# Altium schematic sheet Inverter_Power_Stage.SchDoc
size A4; SheetNumber: 4; SheetTotal: 5
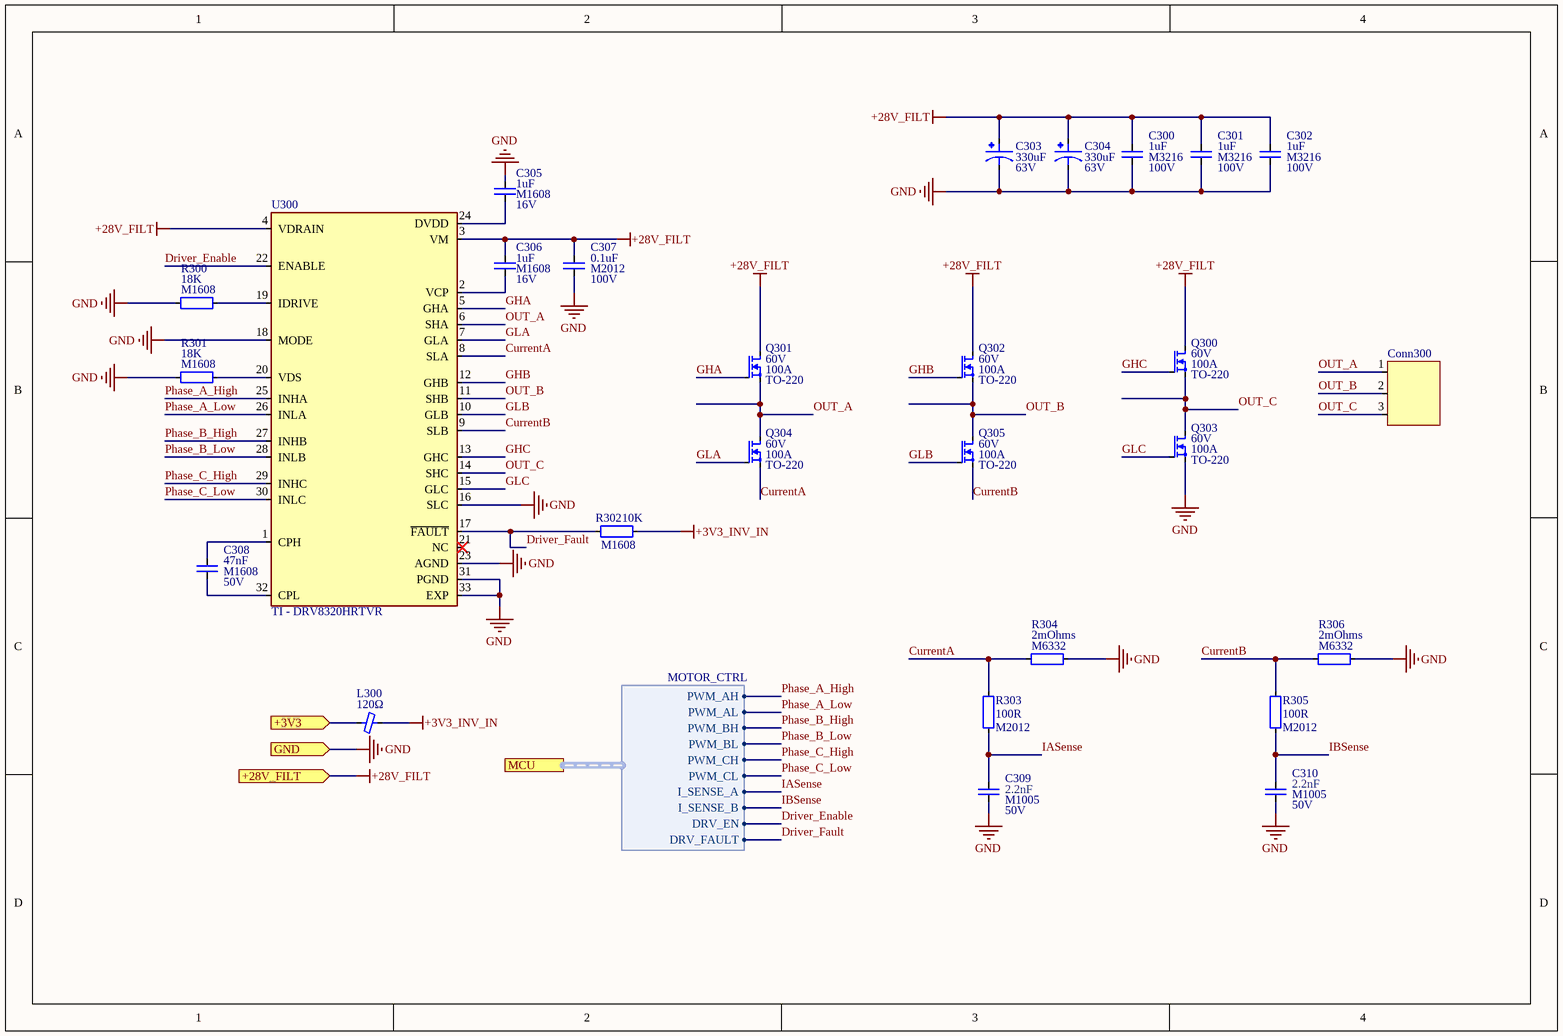
[diagram p0: Inverter_Power_Stage.SchDoc]

## Parts
C300  value 1uF  Package: M3216  Rated Voltage: 100V  [Capacitor_Seramic_M3216_I1206]  (hidden comment: Capacitor_Seramic)
C301  value 1uF  Package: M3216  Rated Voltage: 100V  [Capacitor_Seramic_M3216_I1206]  (hidden comment: Capacitor_Seramic)
C302  value 1uF  Package: M3216  Rated Voltage: 100V  [Capacitor_Seramic_M3216_I1206]  (hidden comment: Capacitor_Seramic)
C303  value 330uF  Rated Voltage: 63V  [Capacitor_Aluminum_TH]  (hidden comment: Capacitor_Aluminum_TH)
C304  value 330uF  Rated Voltage: 63V  [Capacitor_Aluminum_TH]  (hidden comment: Capacitor_Aluminum_TH)
C305  value 1uF  Package: M1608  Rated Voltage: 16V  [Capacitor_Seramic_M1608_I0603]  (hidden comment: Capacitor_Seramic)
C306  value 1uF  Package: M1608  Rated Voltage: 16V  [Capacitor_Seramic_M1608_I0603]  (hidden comment: Capacitor_Seramic)
C307  value 0.1uF  Package: M2012  Rated Voltage: 100V  [Capacitor_Seramic_M2012_I0805]  (hidden comment: Capacitor_Seramic)
C308  value 47nF  Package: M1608  Rated Voltage: 50V  [Capacitor_Seramic_M1608_I0603]  (hidden comment: Capacitor_Seramic)
C309  value 2.2nF  Package: M1005  Rated Voltage: 50V  [Capacitor_Seramic_M1005_I0402]  (hidden comment: Capacitor_Seramic)
C310  value 2.2nF  Package: M1005  Rated Voltage: 50V  [Capacitor_Seramic_M1005_I0402]  (hidden comment: Capacitor_Seramic)
Conn300  Connector - 3P  [Phoenix- 3Pin, 1714968]  (value not drawn)
L300  value 120Ω  [Ferrite_Bead_Smd_M1608_I0603]  (hidden comment: Ferrite Bead)
Q300  Current: 100A  Voltage: 60V  Package: TO-220  [TO-220-3, Mosfet, N-Channel]  (hidden comment: Mosfet, N-Channel - TI - CSD18532KCS)
Q301  Current: 100A  Voltage: 60V  Package: TO-220  [TO-220-3, Mosfet, N-Channel]  (hidden comment: Mosfet, N-Channel - TI - CSD18532KCS)
Q302  Current: 100A  Voltage: 60V  Package: TO-220  [TO-220-3, Mosfet, N-Channel]  (hidden comment: Mosfet, N-Channel - TI - CSD18532KCS)
Q303  Current: 100A  Voltage: 60V  Package: TO-220  [TO-220-3, Mosfet, N-Channel]  (hidden comment: Mosfet, N-Channel - TI - CSD18532KCS)
Q304  Current: 100A  Voltage: 60V  Package: TO-220  [TO-220-3, Mosfet, N-Channel]  (hidden comment: Mosfet, N-Channel - TI - CSD18532KCS)
Q305  Current: 100A  Voltage: 60V  Package: TO-220  [TO-220-3, Mosfet, N-Channel]  (hidden comment: Mosfet, N-Channel - TI - CSD18532KCS)
R300  value 18K  Package: M1608  [Resistor_SMD_M1608_I0603]  (hidden comment: Resistor)
R301  value 18K  Package: M1608  [Resistor_SMD_M1608_I0603]  (hidden comment: Resistor)
R302  value 10K  Package: M1608  [Resistor_SMD_M1608_I0603]  (hidden comment: Resistor)
R303  value 100R  Package: M2012  [Resistor_SMD_M2012_I0805]  (hidden comment: Resistor)
R304  value 2mOhms  Package: M6332  [Resistor_SMD_M6332_I2512]  (hidden comment: Resistor)
R305  value 100R  Package: M2012  [Resistor_SMD_M2012_I0805]  (hidden comment: Resistor)
R306  value 2mOhms  Package: M6332  [Resistor_SMD_M6332_I2512]  (hidden comment: Resistor)
U300  TI - DRV8320HRTVR  [QFN-48 5mm x 5mm]

## Ports
+3V3 (in), +28V_FILT (in), GND (in), MCU (harness MOTOR_CTRL)

## Harnesses
MOTOR_CTRL: PWM_AH, PWM_AL, PWM_BH, PWM_BL, PWM_CH, PWM_CL, I_SENSE_A, I_SENSE_B, DRV_EN, DRV_FAULT

## Nets
+3V3_INV_IN: L300.2 R302.2
+28V_FILT: C300.1 C301.1 C302.1 C303.P C304.P C306.1 C307.1 Q300.D Q301.D Q302.D U300.3(VM) U300.4(VDRAIN) ; port +28V_FILT
GND: C300.2 C301.2 C302.2 C303.N C304.N C305.1 C307.2 C309.1 C310.2 Q303.S R300.1 R301.1 R304.2 R306.2 U300.16(SLC) U300.18(MODE) U300.23(AGND) U300.31(PGND) U300.33(EXP) ; port GND
+3V3: L300.1 ; port +3V3
CurrentA: Q304.S R303.2 R304.1 U300.8(SLA)
CurrentB: Q305.S R305.2 R306.1 U300.9(SLB)
Driver_Enable: U300.22(ENABLE) ; port MCU.DRV_EN
Driver_Fault: R302.1 U300.17(~{FAULT}) ; port MCU.DRV_FAULT
GHA: Q301.G U300.5(GHA)
GHB: Q302.G U300.12(GHB)
GHC: Q300.G U300.13(GHC)
GLA: Q304.G U300.7(GLA)
GLB: Q305.G U300.10(GLB)
GLC: Q303.G U300.15(GLC)
IASense: C309.2 R303.1 ; port MCU.I_SENSE_A
IBSense: C310.1 R305.1 ; port MCU.I_SENSE_B
OUT_A: Conn300.1 Q301.S Q304.D U300.6(SHA)
OUT_B: Conn300.2 Q302.S Q305.D U300.11(SHB)
OUT_C: Conn300.3 Q300.S Q303.D U300.14(SHC)
Phase_A_High: U300.25(INHA) ; port MCU.PWM_AH
Phase_A_Low: U300.26(INLA) ; port MCU.PWM_AL
Phase_B_High: U300.27(INHB) ; port MCU.PWM_BH
Phase_B_Low: U300.28(INLB) ; port MCU.PWM_BL
Phase_C_High: U300.29(INHC) ; port MCU.PWM_CH
Phase_C_Low: U300.30(INLC) ; port MCU.PWM_CL
NetC305_2: C305.2 U300.24(DVDD)
NetC306_2: C306.2 U300.2(VCP)
NetC308_1: C308.1 U300.1(CPH)
NetC308_2: C308.2 U300.32(CPL)
NetR300_2: R300.2 U300.19(IDRIVE)
NetR301_2: R301.2 U300.20(VDS)

Not connected (* = marked no-connect by the designer): U300 21(NC)*

## Library data of the parts
C300-C302 = Capacitor_Seramic: Cap, Cer, 1uF, 100V, M3216; Manufacturer Part Number: C3216X7R2A105K160AA; Manufacturer: TDK Corporation; Tolerance: ±10%; Temperature Coefficient: X7R; ComponentLink1Description: Datasheet; ComponentLink1URL: *; ComponentLink2Description: Supplier Link; ComponentLink2URL: https://www.digikey.com/en/products/detail/tdk-corporation/C3216X7R2A105K160AA/2042138; Supplier Part Number: 445-4467-1-ND; Supplier Link: https://www.digikey.com/en/products/detail/tdk-corporation/C3216X7R2A105K160AA/2042138; Supplier Currency: $; Supplier: Digikey; Quantity, Min: 1; Quantity, Max: 1,000; Price, Min: $0.41000; Price, Max: $0.12024; Operating Temperature, Min: -55℃; Operating Temperature, Max: +125℃; Component Type: Ceramic; Component Category: Capacitor
C303 C304 = Capacitor_Aluminum_TH: 220F 63V Aluminum Electrolytic Capacitors Radial, Can 10000 Hrs @ 105C; Manufacturer: Panasonic Electronic Components; Manufacturer Part Number: EEU-FR1J331; Tolerance: ±20%; Temperature Coefficient: *; Component Category: Capacitor; Component Type: Aluminum; Operating Temperature, Max: +105°C; Operating Temperature, Min: -40°C; ComponentLink1Description: Supplier Link; ComponentLink1URL: https://www.digikey.com/en/products/detail/panasonic-electronic-components/EEU-FR1J331/P15413-ND/3072293; Supplier Part Number: P15413-ND; Supplier Link: https://www.digikey.com/en/products/detail/panasonic-electronic-components/EEU-FR1J331/P15413-ND/3072293; Supplier Currency: $; Supplier: Digikey; Quantity, Min: 1; Quantity, Max: 5,000; Price, Min: $1.73000; Price, Max: $0.51428
C305 C306 = Capacitor_Seramic: Cap, Cer, 1uF, 16V, M1608; Manufacturer Part Number: CL10B105KO8NNNC; Manufacturer: Samsung Electro-Mechanics; Tolerance: ±10%; Temperature Coefficient: X7R; ComponentLink1Description: Datasheet; ComponentLink1URL: *; ComponentLink2Description: Supplier Link; ComponentLink2URL: https://www.digikey.com/en/products/detail/samsung-electro-mechanics/CL10B105KO8NNNC/3886677; Supplier Part Number: 1276-1019-1-ND; Supplier Link: https://www.digikey.com/en/products/detail/samsung-electro-mechanics/CL10B105KO8NNNC/3886677; Supplier Currency: $; Supplier: Digikey; Quantity, Min: 1; Quantity, Max: 1,000; Price, Min: $0.10000; Price, Max: $0.01340; Operating Temperature, Min: -55℃; Operating Temperature, Max: +125℃; Component Type: Ceramic; Component Category: Capacitor
C307 = Capacitor_Seramic: Cap, Cer, 0.1uF, 100V, M2012; Manufacturer Part Number: C2012X7R2A104K125AA; Manufacturer: TDK Corporation; Tolerance: ±10%; Temperature Coefficient: X7R; ComponentLink1Description: Datasheet; ComponentLink1URL: *; ComponentLink2Description: Supplier Link; ComponentLink2URL: https://www.digikey.com/en/products/detail/tdk-corporation/C2012X7R2A104K125AA/569044; Supplier Part Number: 445-1418-1-ND; Supplier Link: https://www.digikey.com/en/products/detail/tdk-corporation/C2012X7R2A104K125AA/569044; Supplier Currency: $; Supplier: Digikey; Quantity, Min: 1; Quantity, Max: 1,000; Price, Min: $0.16000; Price, Max: $0.03714; Operating Temperature, Min: -55℃; Operating Temperature, Max: +125℃; Component Type: Ceramic; Component Category: Capacitor
C308 = Capacitor_Seramic: Cap, Cer, 47nF, 50V, M1608; Manufacturer Part Number: C3216X7R2A105K160AA; Manufacturer: TDK Corporation; Tolerance: ±10%; Temperature Coefficient: X7R; ComponentLink1Description: Datasheet; ComponentLink1URL: *; ComponentLink2Description: Supplier Link; ComponentLink2URL: https://www.digikey.com/en/products/detail/tdk-corporation/C1608X7R1H473K080AA/513823; Supplier Part Number: 445-C1608X7R1H473K080AACT-ND; Supplier Link: https://www.digikey.com/en/products/detail/tdk-corporation/C1608X7R1H473K080AA/513823; Supplier Currency: $; Supplier: Digikey; Quantity, Min: 1; Quantity, Max: 1,000; Price, Min: $0.01969; Price, Max: $0.10000; Operating Temperature, Min: -55℃; Operating Temperature, Max: +125℃; Component Type: Ceramic; Component Category: Capacitor
C309 C310 = Capacitor_Seramic: Cap, Cer, 2.2nF, 50V, M1005; Manufacturer Part Number: GCM155R71H223KA55D; Manufacturer: Murata Electronics; Tolerance: 10%; Temperature Coefficient: X7R; ComponentLink1Description: Datasheet; ComponentLink1URL: *; ComponentLink2Description: Supplier Link; ComponentLink2URL: https://www.digikey.com/en/products/detail/murata-electronics/GCM155R71H223KA55D/1641637; Supplier Part Number: 490-4763-1-ND; Supplier Link: https://www.digikey.com/en/products/detail/murata-electronics/GCM155R71H223KA55D/1641637; Supplier Currency: $; Supplier: Digikey; Quantity, Min: 1; Quantity, Max: 5,000; Price, Min: $0.10000; Price, Max: $0.00769; Operating Temperature, Min: -55℃; Operating Temperature, Max: +125℃; Component Type: Ceramic; Component Category: Capacitor
Conn300 = Connector - 3P: Manufacturer Part Number: 1714968; Manufacturer: Phoenix Contact; Voltage: 300V; Ampere: 3A; ComponentLink1Description: Supplier Link; ComponentLink1URL: https://www.digikey.in/en/products/detail/phoenix-contact/1714968/260638; Supplier Link: https://www.digikey.in/en/products/detail/phoenix-contact/1714968/260638; Price, Max: $1.74640; Supplier Currency: $; Quantity, Max: 25; Quantity, Min: 1; Price, Min: $2.84000; Component Type: Terminal Block; Component Category: Connector; Package: *; Supplier Part Number: 277-1270-ND; Supplier: Digikey
L300 = Ferrite Bead: Manufacturer Part Number: BLM18PG121SN1D; Manufacturer: Murata Electronics; Component Category: Inductor; ComponentLink1Description: Datasheet; ComponentLink1URL: *; ComponentLink2Description: Supplier Link; ComponentLink2URL: https://www.digikey.com/en/products/detail/murata-electronics/BLM18PG121SN1D/584248; Supplier: Digikey; Supplier Part Number: 490-1037-1-ND; Operating Temperature, Min: -55℃; Operating Temperature, Max: +125℃; Quantity, Min: 1; Quantity, Max: 1,000; Price, Min: $0.10000; Price, Max: $0.02791; Supplier Currency: $; Supplier Link: https://www.digikey.com/en/products/detail/murata-electronics/BLM18PG121SN1D/584248; Component Type: Ferrite Bead; Package: M1608
Q300-Q305 = Mosfet, N-Channel - TI - CSD18532KCS: Mosfet, N-Channel - Texas Instruments - CSD18532KCS; Component Category: Transistor; ComponentLink1Description: Datasheet; ComponentLink1URL: C:\Users\User\OneDrive - Karadeniz Teknik University\Masaüstü\pcb\kütüphane\Datasheet\csd18532kcs.pdf; ComponentLink2Description: Supplier Link; ComponentLink2URL: https://www.digikey.com/en/products/detail/texas-instruments/CSD18532KCS/3661861; Manufacturer Part Number: CSD18532KCS; Supplier: Digikey; Supplier Part Number: 296-34941-5-ND; Manufacturer: Texas Instruments; Operating Temperature, Min: -55℃; Operating Temperature, Max: +175℃; Quantity, Min: 1; Quantity, Max: 5,000; Price, Min: $2.90000; Price, Max: $0.87569; Supplier Currency: $; Supplier Link: https://www.digikey.com/en/products/detail/texas-instruments/CSD18532KCS/3661861; Component Type: Mosfet
R300 R301 = Resistor: Res, 18K, 1%, M1608; Manufacturer: YAGEO; Manufacturer Part Number: RC0603FR-0718KL; Supplier: Digikey; Supplier Part Number: 311-18.0KHRCT-ND; Operating Temperature, Min: -55℃; Operating Temperature, Max: +155℃; Quantity, Min: 1; Quantity, Max: 100; Price, Min: $0.10000; Price, Max: $0.00570; Supplier Currency: $; Supplier Link: https://www.digikey.com/en/products/detail/yageo/RC0603FR-0718KL/726989; Tolerance: 1%; Component Type: Fixed Value; Component Category: Resistor; ComponentLink1Description: Datasheet; ComponentLink1URL: *; ComponentLink2Description: Supplier Link; ComponentLink2URL: https://www.digikey.com/en/products/detail/yageo/RC0603FR-0718KL/726989
R302 = Resistor: Res, 10K, 1%, M1608; Manufacturer: YAGEO; Manufacturer Part Number: RC0603FR-0710KL; Supplier: Digikey; Supplier Part Number: 311-10.0KHRCT-ND; Operating Temperature, Min: -55℃; Operating Temperature, Max: +155℃; Quantity, Min: 1; Quantity, Max: 250; Price, Min: $0.10000; Price, Max: $0.00568; Supplier Currency: $; Supplier Link: https://www.digikey.com/en/products/detail/yageo/RC0603FR-0710KL/726880; Tolerance: 1%; Component Type: Fixed Value; Component Category: Resistor; ComponentLink1Description: Datasheet; ComponentLink1URL: *; ComponentLink2Description: Supplier Link; ComponentLink2URL: https://www.digikey.com/en/products/detail/yageo/RC0603FR-0710KL/726880
R303 R305 = Resistor: Res, 100R, 1%, M2012; Manufacturer: Yageo; Manufacturer Part Number: RC0805FR-07100RL; Supplier: Digikey; Supplier Part Number: 311-100CRCT-ND; Operating Temperature, Min: -55℃; Operating Temperature, Max: +155℃; Quantity, Min: 1; Quantity, Max: 50; Price, Min: $0.12000; Price, Max: $0.00820; Supplier Currency: $; Supplier Link: https://www.digikey.com/en/products/detail/yageo/RC0805FR-07100RL/727543; Tolerance: 1%; Component Type: Fixed Value; Component Category: Resistor; ComponentLink1Description: Datasheet; ComponentLink1URL: *; ComponentLink2Description: Supplier Link; ComponentLink2URL: https://www.digikey.com/en/products/detail/yageo/RC0805FR-07100RL/727543
R304 R306 = Resistor: Res, 2moHms, 1%, M6332; Manufacturer: Bourns Inc.; Manufacturer Part Number: CRF2512-FZ-R002ELF; Supplier: Digikey; Supplier Part Number: CRF2512-FZ-R002ELFCT-ND; Operating Temperature, Min: -55℃; Operating Temperature, Max: +155℃; Quantity, Min: 1; Quantity, Max: 1,000; Price, Min: $0.49000; Price, Max: $0.14975; Supplier Currency: $; Supplier Link: https://www.digikey.com/en/products/detail/bourns-inc/CRF2512-FZ-R002ELF/6210983; Tolerance: 1%; Component Type: Fixed Value; Component Category: Resistor; ComponentLink1Description: Datasheet; ComponentLink1URL: C:\Users\Public\Documents\Altium\env\Datasheets\Resistor\Yageo - RC_L Series.pdf; ComponentLink2Description: Supplier Link; ComponentLink2URL: https://www.digikey.com/en/products/detail/bourns-inc/CRF2512-FZ-R002ELF/6210983
U300 = TI - DRV8320HRTVR: 65-V max 3-phase smart gate driver; MF: Texas Instruments; SnapEDA_Link: https://www.snapeda.com/parts/DRV8320HRTVR/Texas+Instruments/view-part/?ref=snap; Package: WQFN-32 Texas Instruments; Value: *; MP: DRV8320HRTVR; Check_prices: https://www.snapeda.com/parts/DRV8320HRTVR/Texas+Instruments/view-part/?ref=eda; ComponentLink1Description: Datasheet; ComponentLink1URL: C:\Users\User\OneDrive - Karadeniz Teknik University\Masaüstü\pcb\kütüphane\Datasheet\drv8320.pdf